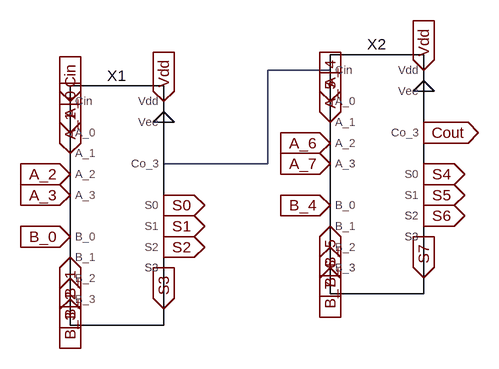
[diagram p0: schematic CLA-8bit.asc]
CLA-8bit.asc, the LTspice schematic file:
Version 4
SHEET 1 880 680
WIRE 336 -48 240 -48
WIRE 240 96 240 -48
WIRE 240 96 80 96
FLAG -64 48 A_0
IOPIN -64 48 In
FLAG -64 80 A_1
IOPIN -64 80 In
FLAG -64 112 A_2
IOPIN -64 112 In
FLAG -64 144 A_3
IOPIN -64 144 In
FLAG 336 0 A_4
IOPIN 336 0 In
FLAG 336 32 A_5
IOPIN 336 32 In
FLAG 336 64 A_6
IOPIN 336 64 In
FLAG 336 96 A_7
IOPIN 336 96 In
FLAG -64 208 B_0
IOPIN -64 208 In
FLAG -64 240 B_1
IOPIN -64 240 In
FLAG -64 272 B_2
IOPIN -64 272 In
FLAG -64 304 B_3
IOPIN -64 304 In
FLAG 336 160 B_4
IOPIN 336 160 In
FLAG 336 192 B_5
IOPIN 336 192 In
FLAG 336 224 B_6
IOPIN 336 224 In
FLAG 336 256 B_7
IOPIN 336 256 In
FLAG 80 160 S0
IOPIN 80 160 Out
FLAG 80 192 S1
IOPIN 80 192 Out
FLAG 80 224 S2
IOPIN 80 224 Out
FLAG 80 256 S3
IOPIN 80 256 Out
FLAG 480 112 S4
IOPIN 480 112 Out
FLAG 480 144 S5
IOPIN 480 144 Out
FLAG 480 176 S6
IOPIN 480 176 Out
FLAG 480 208 S7
IOPIN 480 208 Out
FLAG -64 0 Cin
IOPIN -64 0 In
FLAG 480 48 Cout
IOPIN 480 48 Out
FLAG 80 0 Vdd
IOPIN 80 0 In
FLAG 480 -48 Vdd
IOPIN 480 -48 In
FLAG 80 32 0
FLAG 480 -16 0
SYMBOL CLA-4bit 0 160 R0
SYMATTR InstName X1
SYMBOL CLA-4bit 400 112 R0
SYMATTR InstName X2

The netlist it stands for:
* CLA-8bit.asc
XX1 A_0 A_1 A_2 A_3 B_0 B_1 B_2 B_3 Cin Vdd 0 N001 S0 S1 S2 S3 CLA-4bit  ; pins A_0 A_1 A_2 A_3 B_0 B_1 B_2 B_3 Cin Vdd Vee Co_3 S0 S1 S2 S3
XX2 A_4 A_5 A_6 A_7 B_4 B_5 B_6 B_7 N001 Vdd 0 Cout S4 S5 S6 S7 CLA-4bit  ; pins A_0 A_1 A_2 A_3 B_0 B_1 B_2 B_3 Cin Vdd Vee Co_3 S0 S1 S2 S3
.backanno
.end